# Altium schematic sheet 3DChameleonMK7_2024-11-28.schdoc
size 290 x 206 mm
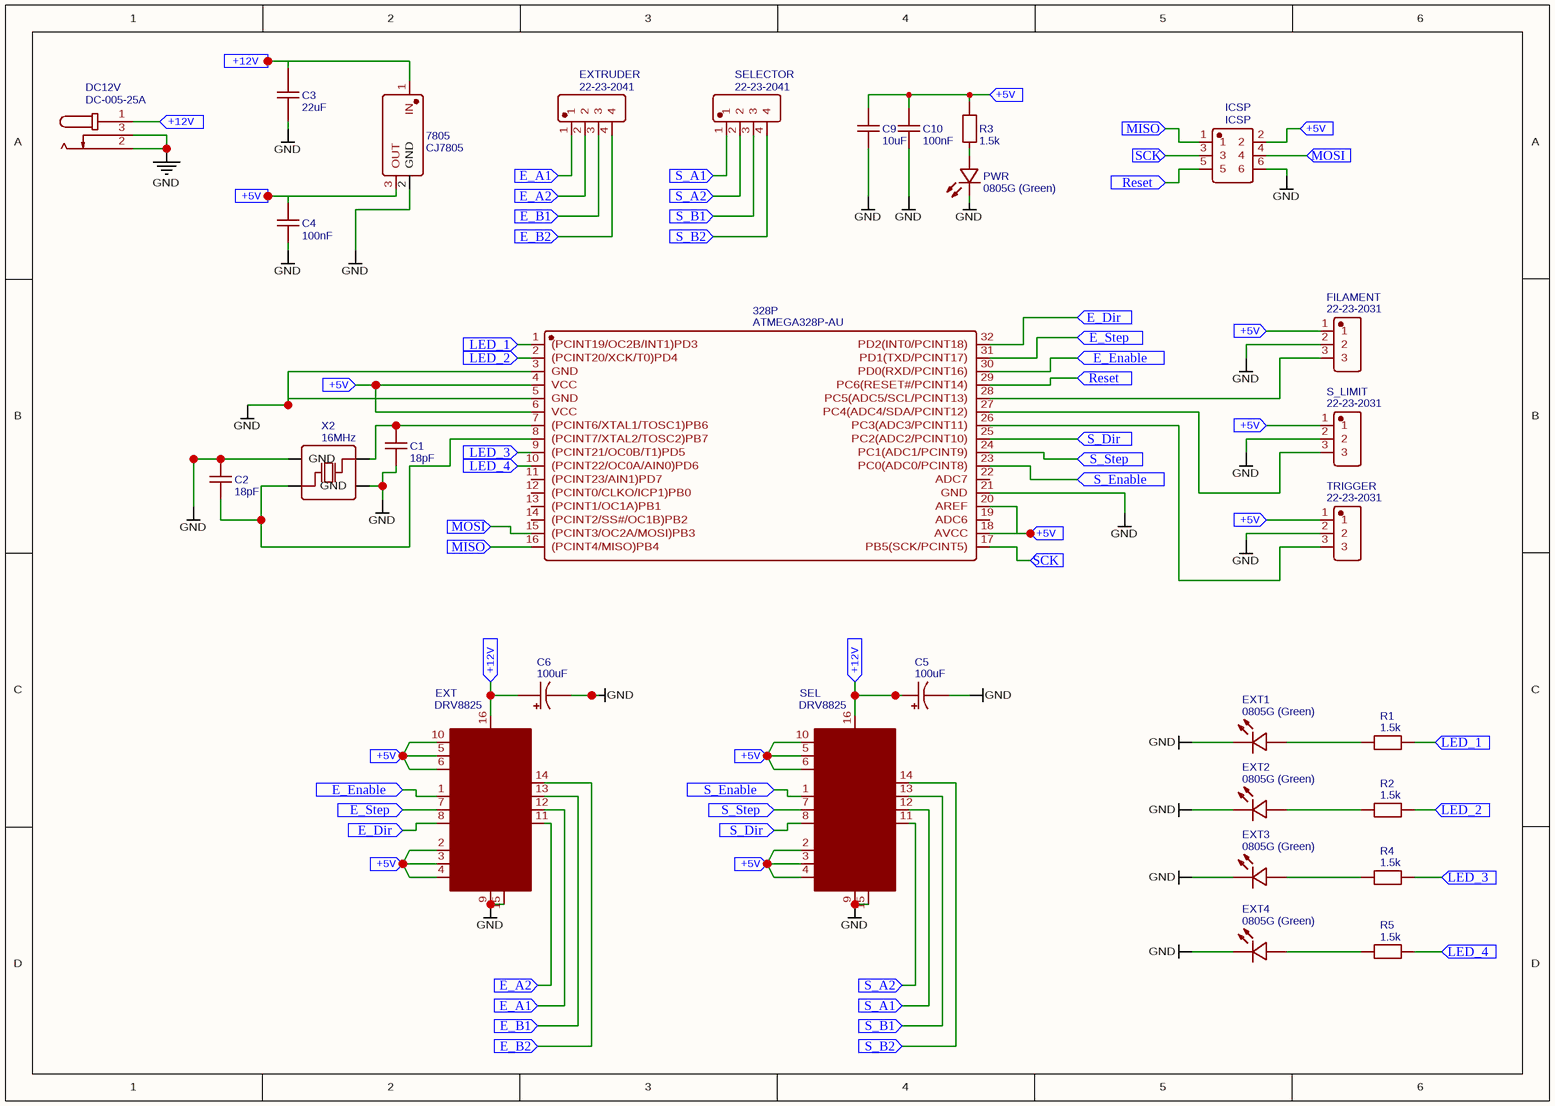
[diagram p0: 3DChameleonMK7_2024-11-28.schdoc]

## Parts
328P  ATMEGA328P-AU  [TQFP-32_L7.0-W7.0-P0.80-LS9.0-BL]
7805  CJ7805  [TO-263-2_L10.1-W9.1-P5.08-LS15.2-TL]
C1  18pF  [C0603]
C2  18pF  [C0603]
C3  22uF  [C0805]
C4  100nF  [C0805]
C5  100uF  [CAP-SMD_BD8.0-L8.3-W8.3-FD]
C6  100uF  [CAP-SMD_BD8.0-L8.3-W8.3-FD]
C9  10uF  [C0805]
C10  100nF  [C0805]
DC12V  DC-005-25A  [DC-IN-TH_DC005]
EXT  DRV8825  [POLOLU_BREAKOUT-16_15.2X20.3MM]
EXT1  0805G (Green)  [LED0805-RD]
EXT2  0805G (Green)  [LED0805-RD]
EXT3  0805G (Green)  [LED0805-RD]
EXT4  0805G (Green)  [LED0805-RD]
EXTRUDER  22-23-2041  [CONN-TH_4P-P2.54_22-23-2041]
FILAMENT  22-23-2031  [CONN-TH_3P-P2.54_22-23-2031]
ICSP  ICSP  [HDR-TH_6P-P2.54-V-R2-C3-S2.54]
PWR  0805G (Green)  [LED0805-RD]
R1  1.5k  [R0603]
R2  1.5k  [R0603]
R3  1.5k  [R0603]
R4  1.5k  [R0603]
R5  1.5k  [R0603]
S_LIMIT  22-23-2031  [CONN-TH_3P-P2.54_22-23-2031]
SEL  DRV8825  [POLOLU_BREAKOUT-16_15.2X20.3MM]
SELECTOR  22-23-2041  [CONN-TH_4P-P2.54_22-23-2041]
TRIGGER  22-23-2031  [CONN-TH_3P-P2.54_22-23-2031]
X2  16MHz  [OSC-SMD_4P-L3.2-W2.5-BL]

## Ports
+5V (in), +12V (in), E_A1 (in), E_A2 (in), E_B1 (in), E_B2 (in), E_Dir (in), E_Enable (in), E_Step (in), LED_1 (in), LED_2 (in), LED_3 (in), LED_4 (in), MISO (in), MOSI (in), Reset (in), S_A1 (in), S_A2 (in), S_B1 (in), S_B2 (in), S_Dir (in), S_Enable (in), S_Step (in), SCK (in)

## Nets
GND: 328P.3(GND) 328P.5(GND) 328P.21(GND) 7805.2(GND) C1.1 C2.2 C3.1 C4.1 C5.2 C6.2 C9.1 C10.1 DC12V.2 DC12V.3 EXT.9(GND) EXT.15(GND) EXT1.1(K) EXT2.1(K) EXT3.1(K) EXT4.1(K) FILAMENT.2 ICSP.6 PWR.1(K) S_LIMIT.2 SEL.9(GND) SEL.15(GND) TRIGGER.2 X2.2(GND) X2.4(GND)
+5V: 328P.4(VCC) 328P.6(VCC) 328P.18(AVCC) 328P.20(AREF) 7805.3(OUT) C4.2 C9.2 C10.2 EXT.2(M0) EXT.3(M1) EXT.4(M2) EXT.5(RST) EXT.6(SLP) EXT.10(FLT) FILAMENT.1 ICSP.2 R3.2 S_LIMIT.1 SEL.2(M0) SEL.3(M1) SEL.4(M2) SEL.5(RST) SEL.6(SLP) SEL.10(FLT) TRIGGER.1 ; port +5V
+12V: 7805.1(IN) C3.2 C5.1 C6.1 DC12V.1 EXT.16(VMOT) SEL.16(VMOT) ; port +12V
E_A1: EXT.12(A1) EXTRUDER.1 ; port E_A1
E_A2: EXT.11(A2) EXTRUDER.2 ; port E_A2
E_B1: EXT.13(B1) EXTRUDER.3 ; port E_B1
E_B2: EXT.14(B2) EXTRUDER.4 ; port E_B2
E_Dir: 328P.32(PD2(INT0/PCINT18)) EXT.8(DIR) ; port E_Dir
E_Enable: 328P.30(PD0(RXD/PCINT16)) EXT.1(EN) ; port E_Enable
E_Step: 328P.31(PD1(TXD/PCINT17)) EXT.7(STEP) ; port E_Step
LED_1: 328P.1((PCINT19/OC2B/INT1)PD3) R1.1 ; port LED_1
LED_2: 328P.2((PCINT20/XCK/T0)PD4) R2.1 ; port LED_2
LED_3: 328P.9((PCINT21/OC0B/T1)PD5) R4.1 ; port LED_3
LED_4: 328P.10((PCINT22/OC0A/AIN0)PD6) R5.1 ; port LED_4
MISO: 328P.16((PCINT4/MISO)PB4) ICSP.1 ; port MISO
MOSI: 328P.15((PCINT3/OC2A/MOSI)PB3) ICSP.4 ; port MOSI
Reset: 328P.29(PC6(RESET#/PCINT14)) ICSP.5 ; port Reset
S_A1: SEL.12(A1) SELECTOR.1 ; port S_A1
S_A2: SEL.11(A2) SELECTOR.2 ; port S_A2
S_B1: SEL.13(B1) SELECTOR.3 ; port S_B1
S_B2: SEL.14(B2) SELECTOR.4 ; port S_B2
S_Dir: 328P.25(PC2(ADC2/PCINT10)) SEL.8(DIR) ; port S_Dir
S_Enable: 328P.23(PC0(ADC0/PCINT8)) SEL.1(EN) ; port S_Enable
S_Step: 328P.24(PC1(ADC1/PCINT9)) SEL.7(STEP) ; port S_Step
SCK: 328P.17(PB5(SCK/PCINT5)) ICSP.3 ; port SCK
Net328P_7: 328P.7((PCINT6/XTAL1/TOSC1)PB6) C1.2 X2.3(OSC2)
Net328P_8: 328P.8((PCINT7/XTAL2/TOSC2)PB7) C2.1 X2.1(OSC1)
Net328P_26: 328P.26(PC3(ADC3/PCINT11)) TRIGGER.3
Net328P_27: 328P.27(PC4(ADC4/SDA/PCINT12)) S_LIMIT.3
Net328P_28: 328P.28(PC5(ADC5/SCL/PCINT13)) FILAMENT.3
NetEXT1_2: EXT1.2(A) R1.2
NetEXT2_2: EXT2.2(A) R2.2
NetEXT3_2: EXT3.2(A) R4.2
NetEXT4_2: EXT4.2(A) R5.2
NetPWR_2: PWR.2(A) R3.1

Not connected (* = marked no-connect by the designer): 328P 11((PCINT23/AIN1)PD7) 12((PCINT0/CLKO/ICP1)PB0) 13((PCINT1/OC1A)PB1) 14((PCINT2/SS#/OC1B)PB2) 19(ADC6) 22(ADC7)

## Library data of the parts
328P = ATMEGA328P-AU: Manufacturer: MICROCHIP; SMT Type: Extend; Supplier: LCSC; Manufacturer Part: ATMEGA328P-AU; image: //image.lceda.cn/szlcsc/C14877.jpg; Supplier Part: C14877; LCSC Assembly: Yes; spicePre: U; spiceSymbolName: ATMEGA328P-AU
7805 = CJ7805: Manufacturer: CJ; Contributor: LCSC; SMT Type: Extend; Supplier: LCSC; Manufacturer Part: CJ7805; Supplier Part: C131137; LCSC Assembly: Yes; spicePre: U; spiceSymbolName: CJ7805
C1 C2 = 18pF: Manufacturer: Zhejiang Abel Elec; nameAlias: Capacitance; SMT Type: Basic; Supplier: LCSC; Manufacturer Part: -; LCSC Assembly: Yes; Supplier Part: C362471; spicePre: C; spiceSymbolName: CL10C180JB8NNNC
C3 = 22uF: Manufacturer: SAMSUNG; Manufacturer Part: CL21A226MAQNNNE; nameAlias: Capacitance; SMT Type: Basic; Supplier: LCSC; LCSC Assembly: Yes; Supplier Part: C45783; spicePre: C; spiceSymbolName: CL21A226MAQNNNE
C4 C10 = 100nF: Manufacturer Part: CL21B104JBCNNNC; Manufacturer: SAMSUNG; nameAlias: Capacitance; SMT Type: Extend; Supplier: LCSC; Supplier Part: C62912; LCSC Assembly: Yes; spicePre: C; spiceSymbolName: CL21B104JBCNNNC
C5 C6 = 100uF: Manufacturer: CEC; Manufacturer Part: CA45-B-6.3V-100uF-K; nameAlias: Capacitance; Contributor: LCSC; SMT Type: Extend; Supplier: LCSC; Supplier Part: C129289; LCSC Assembly: Yes; spicePre: C; spiceSymbolName: VUA101M1ATR-0806L
C9 = 10uF: Manufacturer Part: CL21A106KAYNNNE; Manufacturer: SAMSUNG; nameAlias: Capacitance; SMT Type: Basic; Supplier: LCSC; LCSC Assembly: Yes; Supplier Part: C15850; spicePre: C; spiceSymbolName: CL21A106KAYNNNE
DC12V = DC-005-25A: Manufacturer: HRO; Contributor: LCSC; Supplier: LCSC; Manufacturer Part: DC-005-25A; Supplier Part: C136715; spicePre: D; spiceSymbolName: DC-005-25A
EXT SEL = DRV8825: Contributor: OldJeffer; license: https://www.gnu.org/licenses/lgpl-2.1.html; spicePre: A; spiceSymbolName: DRV8825
EXT1-EXT4 PWR = 0805G (Green): Manufacturer: KENTO; SMT Type: Basic; Supplier: LCSC; Manufacturer Part: 0805G (Green); LCSC Assembly: Yes; image: //image.lceda.cn/szlcsc/C2297.jpg; Supplier Part: C2297; spicePre: L; spiceSymbolName: 0805G (Green)
EXTRUDER SELECTOR = 22-23-2041: Manufacturer: MOLEX; Contributor: LCSC; Supplier: LCSC; Supplier Part: C428629; Manufacturer Part: 22-23-2041; spicePre: C; spiceSymbolName: 22-23-2041
FILAMENT S_LIMIT TRIGGER = 22-23-2031: Manufacturer: MOLEX; Contributor: LCSC; Supplier: LCSC; Supplier Part: C234181; Manufacturer Part: 22-23-2031; spicePre: C; spiceSymbolName: 22-23-2031
ICSP = ICSP: Manufacturer: ReliaPro; Manufacturer Part: Female header/2.54mm2x3 Female header; Supplier Part: C47552; Supplier: LCSC; spicePre: H; spiceSymbolName: Female header/2.54mm2x3 Female header
R1-R5 = 1.5k: Manufacturer: RALEC; Manufacturer Part: RAT034700FTP; nameAlias: Resistance (Ohms); Contributor: LCSC; Supplier: LCSC; Supplier Part: C304484; spicePre: R; spiceSymbolName: RAT034700FTP
X2 = 16MHz: Manufacturer: ZheJiang East Crystal Elec; Manufacturer Part: M16000B222; nameAlias: Frequency; Contributor: LCSC; SMT Type: Extend; Supplier: LCSC; Supplier Part: C258944; LCSC Assembly: Yes; spicePre: X; spiceSymbolName: M16000B222